# Altium schematic sheet Motor_MS_v1.0.SchDoc
size A4
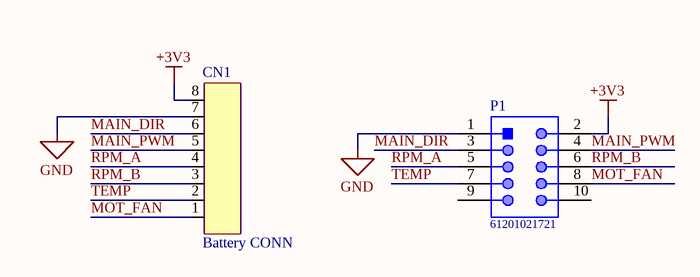
[diagram p0: Motor_MS_v1.0.SchDoc]

## Parts
CN1  Battery CONN  [1747786-1]
P1  61201021721  [61201021721]

## Nets
+3V3: CN1.8 P1.2
GND: CN1.7 P1.1
MAIN_DIR: CN1.6 P1.3
MAIN_PWM: CN1.5 P1.4
MOT_FAN: CN1.1 P1.8
RPM_A: CN1.4 P1.5
RPM_B: CN1.3 P1.6
TEMP: CN1.2 P1.7

Not connected (* = marked no-connect by the designer): P1 9 10

## Library data of the parts
CN1 = 1747786-1
P1 = CMP-1502-00021-1: Male Box Header WR-BHD, THT, Angled, pitch 2.54 mm, 10 pins; Manufacturer: Wurth Elektronik; Pin Number: 10; Contact Resistance: 20mOhm; Working Voltage: 250VAC; Pitch: 2.54mm; Withstanding Voltage: 500VAC; Mounting Technology: THT; Publisher: WurthElektronik; Gender: Male; Part Number: 61201021721; Package Reference: 61201021721; Orientation: Angled; Published Date: August2018; Packaging: Tray; Manufacturer URL: http://www.we-online.de; Operating Temperature: -40to125degC; Datasheet URL: https://katalog.we-online.de/em/datasheet/6120xx21721.pdf